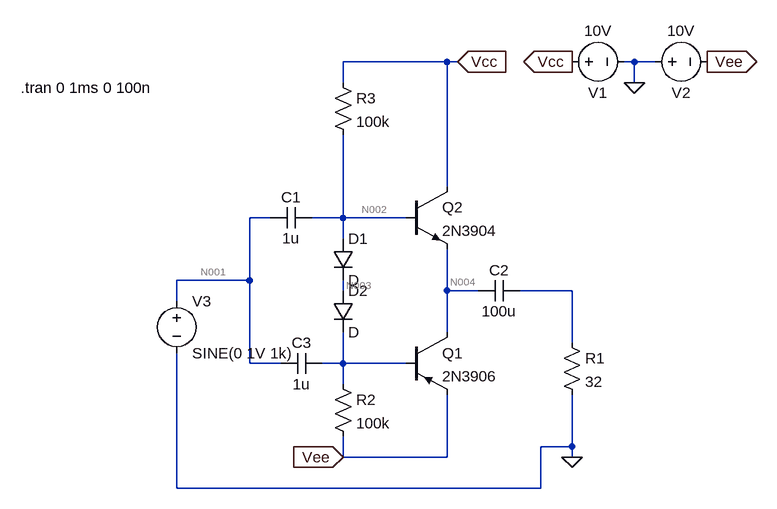
[diagram p0: schematic power_amp.asc]
power_amp.asc, the LTspice schematic file:
Version 4.1
SHEET 1 1704 680
WIRE 32 -352 -128 -352
WIRE 48 -352 32 -352
WIRE 320 -352 304 -352
WIRE 352 -352 320 -352
WIRE -128 -320 -128 -352
WIRE 320 -320 320 -352
WIRE 32 -160 32 -352
WIRE -240 -112 -272 -112
WIRE -128 -112 -128 -240
WIRE -128 -112 -176 -112
WIRE -32 -112 -128 -112
WIRE -128 -80 -128 -112
WIRE -272 -16 -272 -112
WIRE -272 -16 -384 -16
WIRE -128 0 -128 -16
WIRE 32 0 32 -64
WIRE 80 0 32 0
WIRE 224 0 144 0
WIRE -384 16 -384 -16
WIRE 32 64 32 0
WIRE 224 80 224 0
WIRE -272 112 -272 -16
WIRE -224 112 -272 112
WIRE -128 112 -128 64
WIRE -128 112 -160 112
WIRE -32 112 -128 112
WIRE -128 144 -128 112
WIRE 224 240 224 160
WIRE 224 240 176 240
WIRE -128 256 -128 224
WIRE 32 256 32 160
WIRE 32 256 -128 256
WIRE 224 256 224 240
WIRE -384 304 -384 96
WIRE 176 304 176 240
WIRE 176 304 -384 304
FLAG 224 -352 Vcc
IOPIN 224 -352 Out
FLAG 432 -352 Vee
IOPIN 432 -352 Out
FLAG 320 -320 0
FLAG -128 256 Vee
IOPIN -128 256 In
FLAG 224 256 0
FLAG 48 -352 Vcc
IOPIN 48 -352 In
SYMBOL pnp -32 64 R0
SYMATTR InstName Q1
SYMATTR Value 2N3906
SYMBOL npn -32 -160 R0
SYMATTR InstName Q2
SYMATTR Value 2N3904
SYMBOL voltage 208 -352 R270
WINDOW 0 -32 56 VBottom 2
WINDOW 3 32 56 VTop 2
WINDOW 123 0 0 Left 0
WINDOW 39 0 0 Left 0
SYMATTR InstName V1
SYMATTR Value 10V
SYMBOL voltage 336 -352 R270
WINDOW 0 -32 56 VBottom 2
WINDOW 3 32 56 VTop 2
WINDOW 123 0 0 Left 0
WINDOW 39 0 0 Left 0
SYMATTR InstName V2
SYMATTR Value 10V
SYMBOL res 208 64 R0
SYMATTR InstName R1
SYMATTR Value 32
SYMBOL res -144 -336 R0
SYMATTR InstName R3
SYMATTR Value 100k
SYMBOL diode -144 -80 R0
SYMATTR InstName D1
SYMBOL diode -144 0 R0
SYMATTR InstName D2
SYMBOL res -144 128 R0
SYMATTR InstName R2
SYMATTR Value 100k
SYMBOL cap -176 -128 R90
WINDOW 0 0 32 VBottom 2
WINDOW 3 32 32 VTop 2
SYMATTR InstName C1
SYMATTR Value 1u
SYMBOL cap 144 -16 R90
WINDOW 0 0 32 VBottom 2
WINDOW 3 32 32 VTop 2
SYMATTR InstName C2
SYMATTR Value 100u
SYMBOL cap -160 96 R90
WINDOW 0 0 32 VBottom 2
WINDOW 3 32 32 VTop 2
SYMATTR InstName C3
SYMATTR Value 1u
SYMBOL voltage -384 0 R0
WINDOW 123 0 0 Left 0
WINDOW 39 0 0 Left 0
SYMATTR InstName V3
SYMATTR Value SINE(0 1V 1k)
TEXT -624 -312 Left 2 !.tran 0 1ms 0 100n

The netlist it stands for:
* power_amp.asc
Q1 N004 N006 Vee 0 2N3906
Q2 Vcc N002 N004 0 2N3904
V1 Vcc 0 10V
V2 0 Vee 10V
R1 N005 0 32
R3 Vcc N002 100k
D1 N002 N003 D
D2 N003 N006 D
R2 N006 Vee 100k
C1 N002 N001 1u
C2 N005 N004 100u
C3 N006 N001 1u
V3 N001 0 SINE(0 1V 1k)
.model D D
.lib standard.dio
.model NPN NPN
.model PNP PNP
.lib standard.bjt
.tran 0 1ms 0 100n
.backanno
.end

* Results of the author's LTspice run, read from the files saved beside the schematic
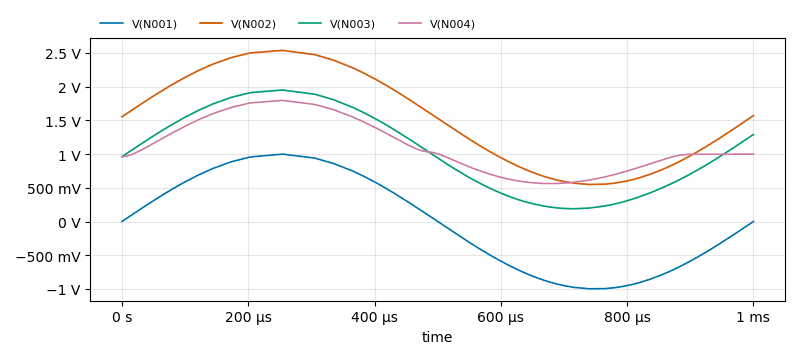
[diagram p1: Transient Analysis of power_amp.asc, plotted from the saved traces]
* Transient Analysis, 1 run:
*   V(N001): min -998.1 mV, max 999.6 mV, average -1.047 mV, rms 705.5 mV, last 0 V
*   V(N002): min 549.2 mV, max 2.538 V, average 1.543 V, rms 1.695 V, last 1.571 V
*   V(N003): min 189.1 mV, max 1.95 V, average 1.057 V, rms 1.22 V, last 1.29 V
*   V(N004): min 562.4 mV, max 1.796 V, average 1.124 V, rms 1.195 V, last 998.9 mV